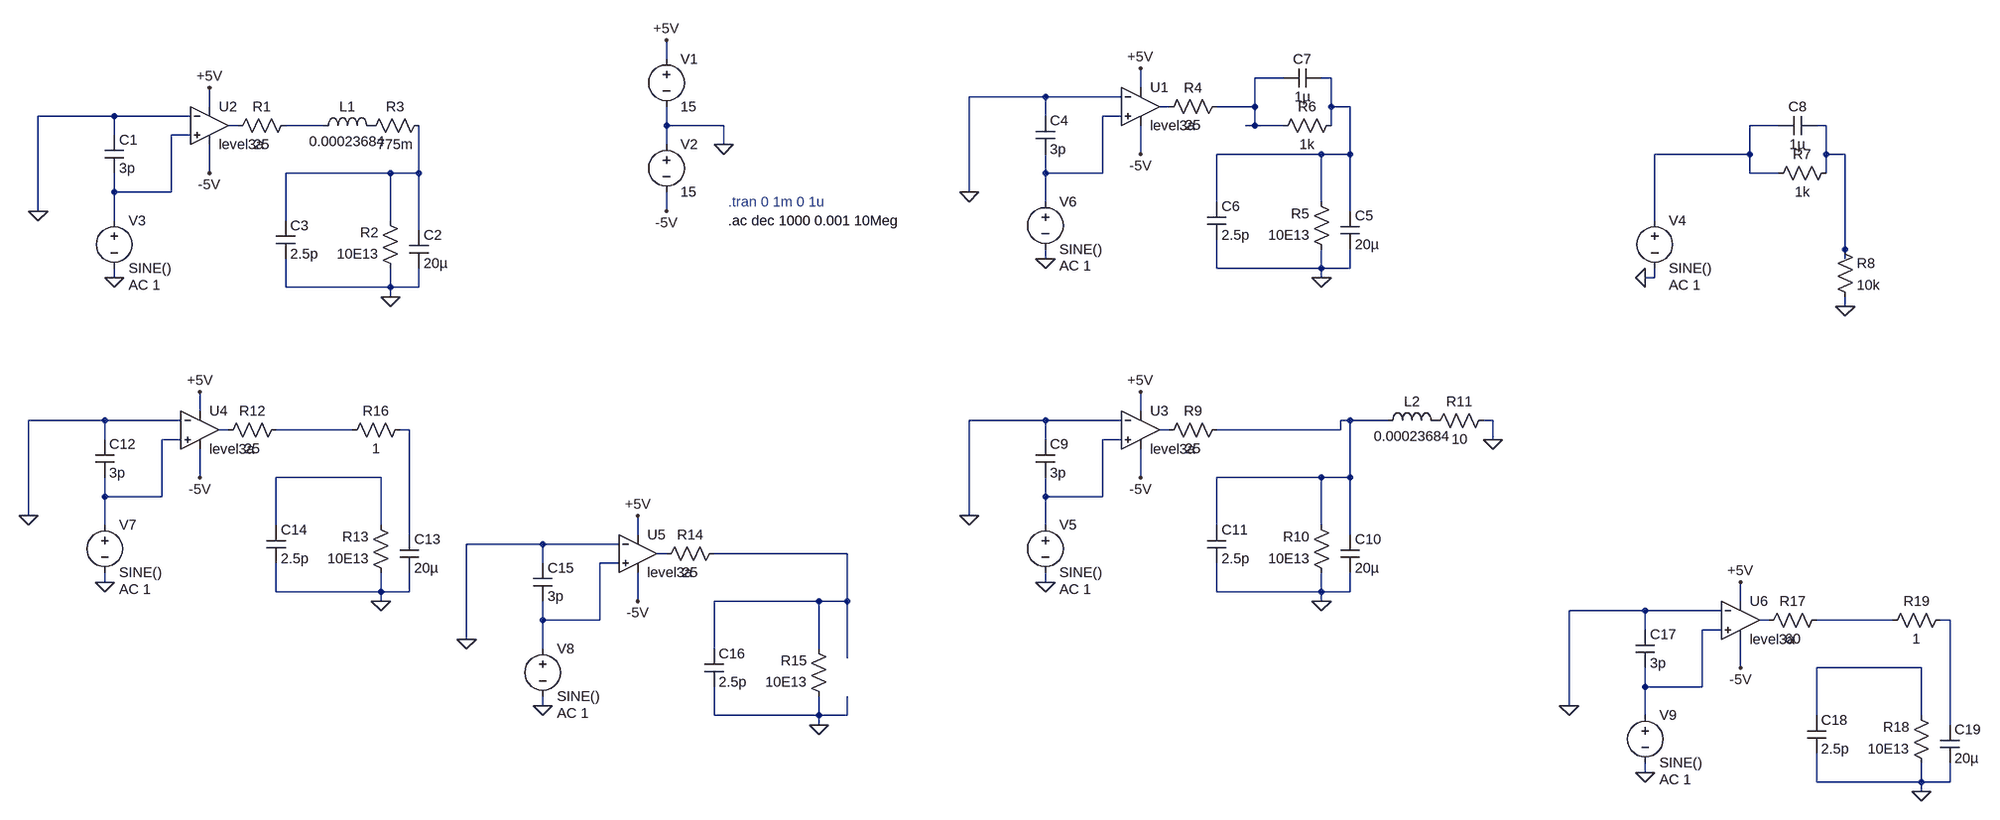
[diagram p0: schematic LTSPice.asc]
LTSPice.asc, the LTspice schematic file:
Version 4
SHEET 1 2936 1284
WIRE 720 32 720 0
WIRE 1760 64 1712 64
WIRE 1840 64 1824 64
WIRE 1520 80 1520 48
WIRE 1360 96 1232 96
WIRE 1488 96 1360 96
WIRE -48 112 -48 80
WIRE 1568 112 1552 112
WIRE 1712 112 1712 64
WIRE 1712 112 1648 112
WIRE 1840 112 1840 64
WIRE 1872 112 1840 112
WIRE -208 128 -336 128
WIRE -80 128 -208 128
WIRE 1360 128 1360 96
WIRE 1488 128 1456 128
WIRE 0 144 -16 144
WIRE 144 144 80 144
WIRE 720 144 720 112
WIRE 816 144 720 144
WIRE 1712 144 1712 112
WIRE 1712 144 1696 144
WIRE 1760 144 1712 144
WIRE 1840 144 1840 112
WIRE 2592 144 2544 144
WIRE 2672 144 2656 144
WIRE -208 160 -208 128
WIRE -80 160 -112 160
WIRE 720 176 720 144
WIRE 816 176 816 144
WIRE 1520 192 1520 144
WIRE 1824 192 1648 192
WIRE 1872 192 1872 112
WIRE 1872 192 1824 192
WIRE 2544 192 2544 144
WIRE 2544 192 2384 192
WIRE 2672 192 2672 144
WIRE 2704 192 2672 192
WIRE -48 224 -48 176
WIRE 256 224 80 224
WIRE 304 224 304 144
WIRE 304 224 256 224
WIRE 1360 224 1360 192
WIRE 1456 224 1456 128
WIRE 1456 224 1360 224
WIRE 2544 224 2544 192
WIRE 2592 224 2544 224
WIRE 2672 224 2672 192
WIRE -208 256 -208 224
WIRE -112 256 -112 160
WIRE -112 256 -208 256
WIRE 1232 256 1232 96
WIRE 1360 272 1360 224
WIRE 1648 272 1648 192
WIRE 1824 272 1824 192
WIRE -336 288 -336 128
WIRE 720 288 720 256
WIRE 1872 288 1872 192
WIRE -208 304 -208 256
WIRE 80 304 80 224
WIRE 256 304 256 224
WIRE 2384 304 2384 192
WIRE 304 320 304 224
WIRE 2704 352 2704 192
WIRE 1360 368 1360 352
WIRE 2704 368 2704 352
WIRE 1648 384 1648 336
WIRE 1824 384 1824 352
WIRE 1824 384 1648 384
WIRE 1872 384 1872 352
WIRE 1872 384 1824 384
WIRE -208 400 -208 384
WIRE 1824 400 1824 384
WIRE 2384 400 2384 384
WIRE 2384 400 2368 400
WIRE 80 416 80 368
WIRE 256 416 256 384
WIRE 256 416 80 416
WIRE 304 416 304 384
WIRE 304 416 256 416
WIRE 256 432 256 416
WIRE 2704 448 2704 432
WIRE -64 624 -64 592
WIRE 1520 624 1520 592
WIRE -224 640 -352 640
WIRE -96 640 -224 640
WIRE 1360 640 1232 640
WIRE 1488 640 1360 640
WIRE 1872 640 1856 640
WIRE 1936 640 1872 640
WIRE 2112 640 2096 640
WIRE -16 656 -32 656
WIRE 192 656 64 656
WIRE 288 656 272 656
WIRE 1568 656 1552 656
WIRE 1856 656 1856 640
WIRE 1856 656 1648 656
WIRE -224 672 -224 640
WIRE -96 672 -128 672
WIRE 1360 672 1360 640
WIRE 1488 672 1456 672
WIRE 2112 672 2112 640
WIRE -64 736 -64 688
WIRE 240 736 64 736
WIRE 1520 736 1520 688
WIRE 1824 736 1648 736
WIRE 1872 736 1872 640
WIRE 1872 736 1824 736
WIRE -224 768 -224 736
WIRE -128 768 -128 672
WIRE -128 768 -224 768
WIRE 1360 768 1360 736
WIRE 1456 768 1456 672
WIRE 1456 768 1360 768
WIRE -352 800 -352 640
WIRE 1232 800 1232 640
WIRE -224 816 -224 768
WIRE 64 816 64 736
WIRE 240 816 240 736
WIRE 1360 816 1360 768
WIRE 1648 816 1648 736
WIRE 1824 816 1824 736
WIRE 288 832 288 656
WIRE 672 832 672 800
WIRE 1872 832 1872 736
WIRE 512 848 384 848
WIRE 640 848 512 848
WIRE 720 864 704 864
WIRE 1024 864 800 864
WIRE 512 880 512 848
WIRE 640 880 608 880
WIRE -224 912 -224 896
WIRE 1360 912 1360 896
WIRE 64 928 64 880
WIRE 240 928 240 896
WIRE 240 928 64 928
WIRE 288 928 288 896
WIRE 288 928 240 928
WIRE 1648 928 1648 880
WIRE 1824 928 1824 896
WIRE 1824 928 1648 928
WIRE 1872 928 1872 896
WIRE 1872 928 1824 928
WIRE 240 944 240 928
WIRE 672 944 672 896
WIRE 976 944 800 944
WIRE 1024 944 1024 864
WIRE 1024 944 976 944
WIRE 1824 944 1824 928
WIRE 2528 944 2528 912
WIRE 2368 960 2240 960
WIRE 2496 960 2368 960
WIRE 512 976 512 944
WIRE 608 976 608 880
WIRE 608 976 512 976
WIRE 2576 976 2560 976
WIRE 2784 976 2656 976
WIRE 2880 976 2864 976
WIRE 2368 992 2368 960
WIRE 2496 992 2464 992
WIRE 384 1008 384 848
WIRE 512 1024 512 976
WIRE 800 1024 800 944
WIRE 976 1024 976 944
WIRE 1024 1040 1024 944
WIRE 2528 1056 2528 1008
WIRE 2832 1056 2656 1056
WIRE 2368 1088 2368 1056
WIRE 2464 1088 2464 992
WIRE 2464 1088 2368 1088
WIRE 512 1120 512 1104
WIRE 2240 1120 2240 960
WIRE 800 1136 800 1088
WIRE 976 1136 976 1104
WIRE 976 1136 800 1136
WIRE 1024 1136 1024 1104
WIRE 1024 1136 976 1136
WIRE 2368 1136 2368 1088
WIRE 2656 1136 2656 1056
WIRE 2832 1136 2832 1056
WIRE 976 1152 976 1136
WIRE 2880 1152 2880 976
WIRE 2368 1232 2368 1216
WIRE 2656 1248 2656 1200
WIRE 2832 1248 2832 1216
WIRE 2832 1248 2656 1248
WIRE 2880 1248 2880 1216
WIRE 2880 1248 2832 1248
WIRE 2832 1264 2832 1248
FLAG 816 176 0
FLAG 720 288 -5V
FLAG 720 0 +5V
FLAG -48 80 +5V
FLAG -48 224 -5V
FLAG -208 400 0
FLAG 256 432 0
FLAG -336 288 0
FLAG 1520 48 +5V
FLAG 1520 192 -5V
FLAG 1360 368 0
FLAG 1824 400 0
FLAG 1232 256 0
FLAG 2368 400 0
FLAG 2704 448 0
FLAG 1520 592 +5V
FLAG 1520 736 -5V
FLAG 1360 912 0
FLAG 1824 944 0
FLAG 1232 800 0
FLAG 2112 672 0
FLAG -64 592 +5V
FLAG -64 736 -5V
FLAG -224 912 0
FLAG 240 944 0
FLAG -352 800 0
FLAG 672 800 +5V
FLAG 672 944 -5V
FLAG 512 1120 0
FLAG 976 1152 0
FLAG 384 1008 0
FLAG 2528 912 +5V
FLAG 2528 1056 -5V
FLAG 2368 1232 0
FLAG 2832 1264 0
FLAG 2240 1120 0
SYMBOL voltage 720 16 R0
WINDOW 123 0 0 Left 0
WINDOW 39 0 0 Left 0
SYMATTR InstName V1
SYMATTR Value 15
SYMBOL voltage 720 160 R0
WINDOW 123 0 0 Left 0
WINDOW 39 0 0 Left 0
SYMATTR InstName V2
SYMATTR Value 15
SYMBOL voltage -208 288 R0
WINDOW 123 24 124 Left 2
WINDOW 39 0 0 Left 0
SYMATTR Value2 AC 1
SYMATTR InstName V3
SYMATTR Value SINE()
SYMBOL res 96 128 R90
WINDOW 0 0 56 VBottom 2
WINDOW 3 32 56 VTop 2
SYMATTR InstName R1
SYMATTR Value 25
SYMBOL res 272 400 R180
WINDOW 0 36 76 Left 2
WINDOW 3 36 40 Left 2
SYMATTR InstName R2
SYMATTR Value 10E13
SYMBOL cap -224 160 R0
SYMATTR InstName C1
SYMATTR Value 3p
SYMBOL OpAmps\\UniversalOpAmp3 -48 144 R0
SYMATTR InstName U2
SYMATTR Value2 Avol=5.0119Meg GBW=1Meg Slew=0.8Meg
SYMATTR SpiceLine Ilimit=25m Rail=0 Vos=0 Phimargin=60
SYMATTR SpiceLine2 En=0 Enk=0 In=0 Ink=0 Rin=100Meg
SYMBOL cap 288 320 R0
SYMATTR InstName C2
SYMATTR Value 20µ
SYMBOL cap 64 304 R0
SYMATTR InstName C3
SYMATTR Value 2.5p
SYMBOL ind 128 160 R270
WINDOW 0 32 56 VTop 2
WINDOW 3 5 56 VBottom 2
SYMATTR InstName L1
SYMATTR Value 0.00023684
SYMBOL res 320 128 R90
WINDOW 0 0 56 VBottom 2
WINDOW 3 32 56 VTop 2
SYMATTR InstName R3
SYMATTR Value 775m
SYMBOL voltage 1360 256 R0
WINDOW 123 24 124 Left 2
WINDOW 39 0 0 Left 0
SYMATTR Value2 AC 1
SYMATTR InstName V6
SYMATTR Value SINE()
SYMBOL res 1664 96 R90
WINDOW 0 0 56 VBottom 2
WINDOW 3 32 56 VTop 2
SYMATTR InstName R4
SYMATTR Value 25
SYMBOL res 1840 368 R180
WINDOW 0 36 76 Left 2
WINDOW 3 36 40 Left 2
SYMATTR InstName R5
SYMATTR Value 10E13
SYMBOL cap 1344 128 R0
SYMATTR InstName C4
SYMATTR Value 3p
SYMBOL OpAmps\\UniversalOpAmp3 1520 112 R0
SYMATTR InstName U1
SYMATTR Value2 Avol=5.0119Meg GBW=1Meg Slew=0.8Meg
SYMATTR SpiceLine Ilimit=25m Rail=0 Vos=0 Phimargin=60
SYMATTR SpiceLine2 En=0 Enk=0 In=0 Ink=0 Rin=100Meg
SYMBOL cap 1856 288 R0
SYMATTR InstName C5
SYMATTR Value 20µ
SYMBOL cap 1632 272 R0
SYMATTR InstName C6
SYMATTR Value 2.5p
SYMBOL cap 1824 48 R90
WINDOW 0 0 32 VBottom 2
WINDOW 3 32 32 VTop 2
SYMATTR InstName C7
SYMATTR Value 1µ
SYMBOL res 1856 128 R90
WINDOW 0 0 56 VBottom 2
WINDOW 3 32 56 VTop 2
SYMATTR InstName R6
SYMATTR Value 1k
SYMBOL voltage 2384 288 R0
WINDOW 123 24 124 Left 2
WINDOW 39 0 0 Left 0
SYMATTR Value2 AC 1
SYMATTR InstName V4
SYMATTR Value SINE()
SYMBOL cap 2656 128 R90
WINDOW 0 0 32 VBottom 2
WINDOW 3 32 32 VTop 2
SYMATTR InstName C8
SYMATTR Value 1µ
SYMBOL res 2688 208 R90
WINDOW 0 0 56 VBottom 2
WINDOW 3 32 56 VTop 2
SYMATTR InstName R7
SYMATTR Value 1k
SYMBOL res 2688 336 R0
SYMATTR InstName R8
SYMATTR Value 10k
SYMBOL voltage 1360 800 R0
WINDOW 123 24 124 Left 2
WINDOW 39 0 0 Left 0
SYMATTR Value2 AC 1
SYMATTR InstName V5
SYMATTR Value SINE()
SYMBOL res 1664 640 R90
WINDOW 0 0 56 VBottom 2
WINDOW 3 32 56 VTop 2
SYMATTR InstName R9
SYMATTR Value 25
SYMBOL res 1840 912 R180
WINDOW 0 36 76 Left 2
WINDOW 3 36 40 Left 2
SYMATTR InstName R10
SYMATTR Value 10E13
SYMBOL cap 1344 672 R0
SYMATTR InstName C9
SYMATTR Value 3p
SYMBOL OpAmps\\UniversalOpAmp3 1520 656 R0
SYMATTR InstName U3
SYMATTR Value2 Avol=5.0119Meg GBW=1Meg Slew=0.8Meg
SYMATTR SpiceLine Ilimit=25m Rail=0 Vos=0 Phimargin=60
SYMATTR SpiceLine2 En=0 Enk=0 In=0 Ink=0 Rin=100Meg
SYMBOL cap 1856 832 R0
SYMATTR InstName C10
SYMATTR Value 20µ
SYMBOL cap 1632 816 R0
SYMATTR InstName C11
SYMATTR Value 2.5p
SYMBOL ind 1920 656 R270
WINDOW 0 32 56 VTop 2
WINDOW 3 5 56 VBottom 2
SYMATTR InstName L2
SYMATTR Value 0.00023684
SYMBOL res 2112 624 R90
WINDOW 0 0 56 VBottom 2
WINDOW 3 32 56 VTop 2
SYMATTR InstName R11
SYMATTR Value 10
SYMBOL voltage -224 800 R0
WINDOW 123 24 124 Left 2
WINDOW 39 0 0 Left 0
SYMATTR Value2 AC 1
SYMATTR InstName V7
SYMATTR Value SINE()
SYMBOL res 80 640 R90
WINDOW 0 0 56 VBottom 2
WINDOW 3 32 56 VTop 2
SYMATTR InstName R12
SYMATTR Value 25
SYMBOL res 256 912 R180
WINDOW 0 36 76 Left 2
WINDOW 3 36 40 Left 2
SYMATTR InstName R13
SYMATTR Value 10E13
SYMBOL cap -240 672 R0
SYMATTR InstName C12
SYMATTR Value 3p
SYMBOL OpAmps\\UniversalOpAmp3 -64 656 R0
SYMATTR InstName U4
SYMATTR Value2 Avol=5.0119Meg GBW=1Meg Slew=0.8Meg
SYMATTR SpiceLine Ilimit=25m Rail=0 Vos=0 Phimargin=60
SYMATTR SpiceLine2 En=0 Enk=0 In=0 Ink=0 Rin=100Meg
SYMBOL cap 48 816 R0
SYMATTR InstName C14
SYMATTR Value 2.5p
SYMBOL cap 272 832 R0
SYMATTR InstName C13
SYMATTR Value 20µ
SYMBOL voltage 512 1008 R0
WINDOW 123 24 124 Left 2
WINDOW 39 0 0 Left 0
SYMATTR Value2 AC 1
SYMATTR InstName V8
SYMATTR Value SINE()
SYMBOL res 816 848 R90
WINDOW 0 0 56 VBottom 2
WINDOW 3 32 56 VTop 2
SYMATTR InstName R14
SYMATTR Value 25
SYMBOL res 992 1120 R180
WINDOW 0 36 76 Left 2
WINDOW 3 36 40 Left 2
SYMATTR InstName R15
SYMATTR Value 10E13
SYMBOL cap 496 880 R0
SYMATTR InstName C15
SYMATTR Value 3p
SYMBOL OpAmps\\UniversalOpAmp3 672 864 R0
SYMATTR InstName U5
SYMATTR Value2 Avol=5.0119Meg GBW=1Meg Slew=0.8Meg
SYMATTR SpiceLine Ilimit=25m Rail=0 Vos=0 Phimargin=60
SYMATTR SpiceLine2 En=0 Enk=0 In=0 Ink=0 Rin=100Meg
SYMBOL cap 784 1024 R0
SYMATTR InstName C16
SYMATTR Value 2.5p
SYMBOL res 288 640 R90
WINDOW 0 0 56 VBottom 2
WINDOW 3 32 56 VTop 2
SYMATTR InstName R16
SYMATTR Value 1
SYMBOL voltage 2368 1120 R0
WINDOW 123 24 124 Left 2
WINDOW 39 0 0 Left 0
SYMATTR Value2 AC 1
SYMATTR InstName V9
SYMATTR Value SINE()
SYMBOL res 2672 960 R90
WINDOW 0 0 56 VBottom 2
WINDOW 3 32 56 VTop 2
SYMATTR InstName R17
SYMATTR Value 60
SYMBOL res 2848 1232 R180
WINDOW 0 36 76 Left 2
WINDOW 3 36 40 Left 2
SYMATTR InstName R18
SYMATTR Value 10E13
SYMBOL cap 2352 992 R0
SYMATTR InstName C17
SYMATTR Value 3p
SYMBOL OpAmps\\UniversalOpAmp3 2528 976 R0
SYMATTR InstName U6
SYMATTR Value2 Avol=5.0119Meg GBW=0.7Meg Slew=0.3Meg
SYMATTR SpiceLine Ilimit=25m Rail=0 Vos=0 Phimargin=60
SYMATTR SpiceLine2 En=0 Enk=0 In=0 Ink=0 Rin=100Meg
SYMBOL cap 2640 1136 R0
SYMATTR InstName C18
SYMATTR Value 2.5p
SYMBOL cap 2864 1152 R0
SYMATTR InstName C19
SYMATTR Value 20µ
SYMBOL res 2880 960 R90
WINDOW 0 0 56 VBottom 2
WINDOW 3 32 56 VTop 2
SYMATTR InstName R19
SYMATTR Value 1
TEXT 824 272 Left 2 ;.tran 0 1m 0 1u
TEXT 824 304 Left 2 !.ac dec 1000 0.001 10Meg

The netlist it stands for:
* LTSPice.asc
V1 +5V 0 15
V2 0 -5V 15
V3 N009 0 SINE() AC 1
R1 N006 N005 25
R2 0 N010 10E13
C1 0 N009 3p
XU2 N009 0 +5V -5V N005 level3a Avol=5.0119Meg GBW=1Meg Slew=0.8Meg Ilimit=25m Rail=0 Vos=0 Phimargin=60 En=0 Enk=0 In=0 Ink=0 Rin=100Meg  ; pins In+ In- V+ V- OUT
C2 N010 0 20µ
C3 N010 0 2.5p
L1 N006 P001 0.00023684
R3 N010 P001 775m
V6 N004 0 SINE() AC 1
R4 N001 N003 25
R5 0 N002 10E13
C4 0 N004 3p
XU1 N004 0 +5V -5V N003 level3a Avol=5.0119Meg GBW=1Meg Slew=0.8Meg Ilimit=25m Rail=0 Vos=0 Phimargin=60 En=0 Enk=0 In=0 Ink=0 Rin=100Meg  ; pins In+ In- V+ V- OUT
C5 N002 0 20µ
C6 N002 0 2.5p
C7 N002 N001 1µ
R6 N002 N001 1k
V4 N007 0 SINE() AC 1
C8 N008 N007 1µ
R7 N008 N007 1k
R8 N008 0 10k
V5 N017 0 SINE() AC 1
R9 N011 N015 25
R10 0 N011 10E13
C9 0 N017 3p
XU3 N017 0 +5V -5V N015 level3a Avol=5.0119Meg GBW=1Meg Slew=0.8Meg Ilimit=25m Rail=0 Vos=0 Phimargin=60 En=0 Enk=0 In=0 Ink=0 Rin=100Meg  ; pins In+ In- V+ V- OUT
C10 N011 0 20µ
C11 N011 0 2.5p
L2 N011 P002 0.00023684
R11 0 P002 10
V7 N016 0 SINE() AC 1
R12 N013 N012 25
R13 0 N018 10E13
C12 0 N016 3p
XU4 N016 0 +5V -5V N012 level3a Avol=5.0119Meg GBW=1Meg Slew=0.8Meg Ilimit=25m Rail=0 Vos=0 Phimargin=60 En=0 Enk=0 In=0 Ink=0 Rin=100Meg  ; pins In+ In- V+ V- OUT
C14 N018 0 2.5p
C13 N014 0 20µ
V8 N021 0 SINE() AC 1
R14 N020 N019 25
R15 0 N020 10E13
C15 0 N021 3p
XU5 N021 0 +5V -5V N019 level3a Avol=5.0119Meg GBW=1Meg Slew=0.8Meg Ilimit=25m Rail=0 Vos=0 Phimargin=60 En=0 Enk=0 In=0 Ink=0 Rin=100Meg  ; pins In+ In- V+ V- OUT
C16 N020 0 2.5p
R16 N014 N013 1
V9 N025 0 SINE() AC 1
R17 N023 N022 60
R18 0 N026 10E13
C17 0 N025 3p
XU6 N025 0 +5V -5V N022 level3a Avol=5.0119Meg GBW=0.7Meg Slew=0.3Meg Ilimit=25m Rail=0 Vos=0 Phimargin=60 En=0 Enk=0 In=0 Ink=0 Rin=100Meg  ; pins In+ In- V+ V- OUT
C18 N026 0 2.5p
C19 N024 0 20µ
R19 N024 N023 1
* .tran 0 1m 0 1u
.ac dec 1000 0.001 10Meg
.backanno
.end